# Altium project Vertap.PrjPcb
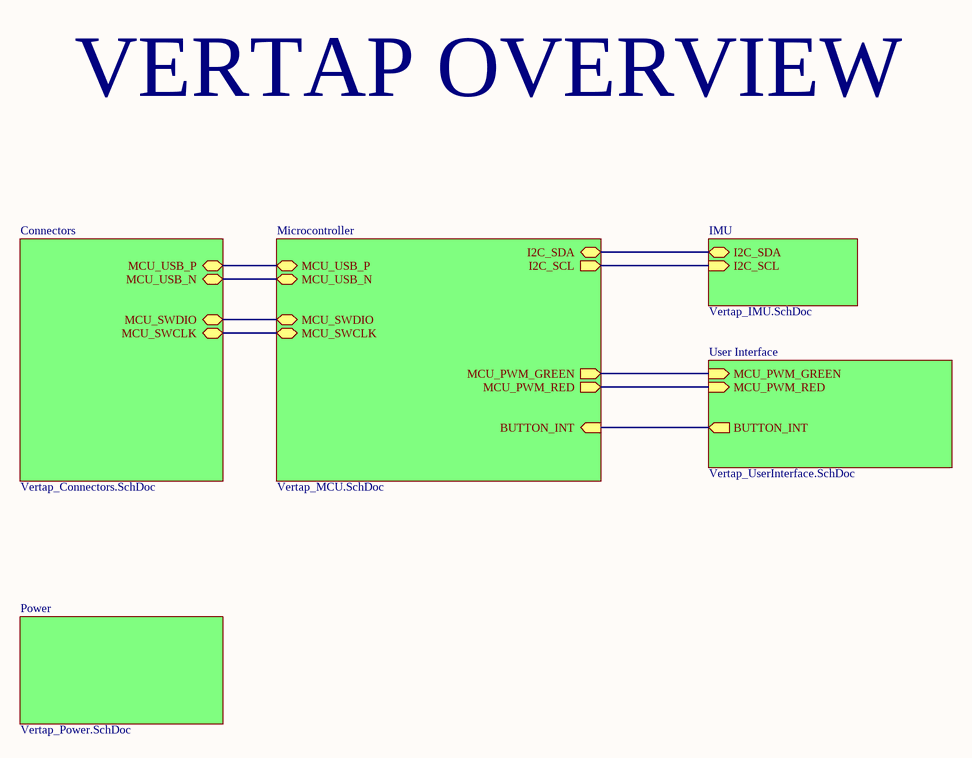
[diagram p0: Vertap_Overview.SchDoc]
6 sheets, 38 parts. Net scope: hierarchical (ports join the sheet entries above them; power ports are global).
Board file: Vertap_PCB.PcbDoc
Sheets:
  Vertap_Overview.SchDoc
    Power = Vertap_Power.SchDoc
    IMU = Vertap_IMU.SchDoc
    Microcontroller = Vertap_MCU.SchDoc
    User Interface = Vertap_UserInterface.SchDoc
    Connectors = Vertap_Connectors.SchDoc

## Sheet Vertap_Overview.SchDoc: Overview
size A4; Author: Taim Al-Dabbagh; DrawnBy: Taim Al-Dabbagh; Revision: v1; SheetNumber: 1; SheetTotal: 6

### Sub-sheets
Connectors = Vertap_Connectors.SchDoc: MCU_SWCLK (bidir), MCU_SWDIO (bidir), MCU_USB_N (bidir), MCU_USB_P (bidir)
IMU = Vertap_IMU.SchDoc: I2C_SDA (bidir), I2C_SCL (in)
Microcontroller = Vertap_MCU.SchDoc: I2C_SDA (bidir), I2C_SCL (out), MCU_SWCLK (bidir), MCU_SWDIO (bidir), MCU_USB_N (bidir), MCU_USB_P (bidir), BUTTON_INT (in), MCU_PWM_GREEN (out), MCU_PWM_RED (out)
Power = Vertap_Power.SchDoc: no entries
User Interface = Vertap_UserInterface.SchDoc: BUTTON_INT (out), MCU_PWM_GREEN (in), MCU_PWM_RED (in)

### Nets
BUTTON_INT: sheet Microcontroller/BUTTON_INT, sheet User Interface/BUTTON_INT
I2C_SCL: sheet IMU/I2C_SCL, sheet Microcontroller/I2C_SCL
I2C_SDA: sheet IMU/I2C_SDA, sheet Microcontroller/I2C_SDA
MCU_PWM_GREEN: sheet Microcontroller/MCU_PWM_GREEN, sheet User Interface/MCU_PWM_GREEN
MCU_PWM_RED: sheet Microcontroller/MCU_PWM_RED, sheet User Interface/MCU_PWM_RED
MCU_SWCLK: sheet Microcontroller/MCU_SWCLK, sheet Connectors/MCU_SWCLK
MCU_SWDIO: sheet Microcontroller/MCU_SWDIO, sheet Connectors/MCU_SWDIO
MCU_USB_N: sheet Microcontroller/MCU_USB_N, sheet Connectors/MCU_USB_N
MCU_USB_P: sheet Microcontroller/MCU_USB_P, sheet Connectors/MCU_USB_P

### Notes on the sheet
- VERTAP OVERVIEW

## Sheet Vertap_Power.SchDoc: Power
size A4; Author: Taim Al-Dabbagh; DrawnBy: Taim Al-Dabbagh; Revision: v1; SheetNumber: 2; SheetTotal: 6
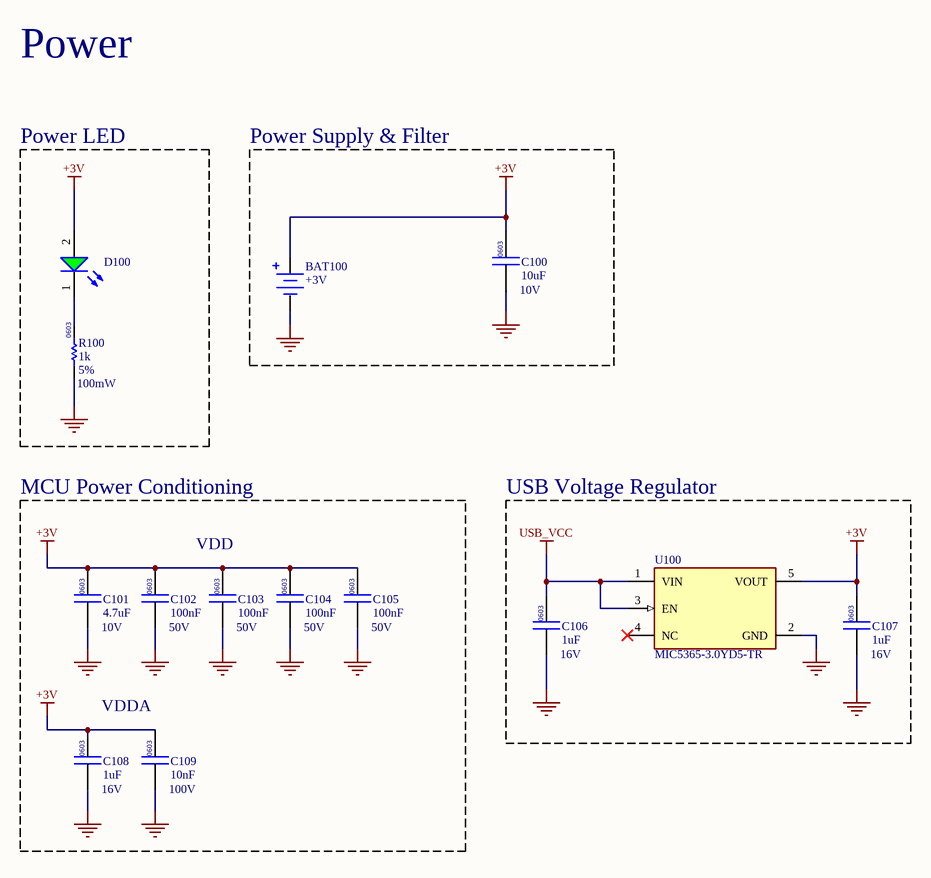
[diagram p1: Vertap_Power.SchDoc]

### Parts
BAT100  +3V  [BH-67D-5]
C100  10uF  [CAP_0603_MURATA]
C101  4.7uF  [CAP_0603_MURATA]
C102  100nF  [CAP_0603_MURATA]
C103  100nF  [CAP_0603_MURATA]
C104  100nF  [CAP_0603_MURATA]
C105  100nF  [CAP_0603_MURATA]
C106  1uF  [CAP_0603_MURATA]
C107  1uF  [CAP_0603_MURATA]
C108  1uF  [CAP_0603_MURATA]
C109  10nF  [CAP_0603_MURATA]
D100  150060VS75000  [WL-SMCW_0603_150060xx75000]  (value not drawn)
R100  1k  [RESC1608X55X25LL10T15]
U100  MIC5365-3.0YD5-TR  [FP-TSOT-5LD-PL-1-MFG]

### Blocks framed on the sheet
Power LED: D100 R100
Power Supply & Filter: BAT100 C100
MCU Power Conditioning: C101-C105 C108 C109
USB Voltage Regulator: C106 C107 U100

### Nets
+3V: BAT100.2(+) C100.1 C101.1 C102.1 C103.1 C104.1 C105.1 C107.1 C108.2 C109.1 D100.2(A) U100.5(VOUT)
GND: BAT100.1(-) C100.2 C101.2 C102.2 C103.2 C104.2 C105.2 C106.2 C107.2 C108.1 C109.2 R100.1 U100.2(GND)
USB_VCC: C106.1 U100.1(VIN) U100.3(EN)
NetD100_1: D100.1(K) R100.2

Not connected (* = marked no-connect by the designer): U100 4(NC)*

### Notes on the sheet
- Power
- (near C100) 0603
- (near C100) 10V
- (near R100) 0603
- (near R100) 100mW
- (near R100) 5%
- (near C101) 0603
- (near C102) 0603
- VDD
- (near C103) 0603
- (near C104) 0603
- (near C105) 0603
- (near C101) 10V
- (near C102) 50V
- (near C103) 50V
- (near C104) 50V
- (near C105) 50V
- (near C106) 0603
- (near C106) 16V
- (near C107) 0603
- (near C107) 16V
- VDDA
- (near C108) 0603
- (near C108) 16V
- (near C109) 0603
- (near C109) 100V

### Library data of the parts
BAT100 = BH-67D-5: BATT RETAINER COIN 20MM 1CEL SMD; Supplier 1: Digi-Key; Supplier Part Number 1: 2057-BH-67D-5-ND
C100 = CAP_10uF_0603: CAP CER 10UF 10V X7R 0603; Supplier 1: Arrow Electronics; Supplier Part Number 1: GRM188Z71A106KA73D
C101 = CAP_4.7uF_0603: CAP CER 4.7UF 10V X7R 0603; Supplier 1: Digi-Key
C102-C105 = CAP_0.1uF_0603: CAP CER 0.1UF 50V X7R 0603; Supplier 1: Mouser; Supplier Part Number 1: 81-GCM188R71H104JA7D
C106-C108 = CAP_1uF_0603: CAP CER 1UF 16V X7R 0603; Supplier 1: Arrow Electronics
  C106 C107: Supplier Part Number 1: GCM188R71C105KA64J
C109 = CAP_10nF_0603: CAP CER 10000PF 100V X7R 0603; Supplier 1: Arrow Electronics; Supplier Part Number 1: GCM188R72A103KA37J
D100 = CMP-1426-00006-6: NexarPartId: 29717778; Reverse Voltage: 5V; Forward Voltage: 2V; Viewing Angle: 140°; Luminous Intensity: 40mcd; Test Current: 20mA; Max Junction Temperature (Tj): 95°C; Wavelength: 570nm; Forward Current: 100mA; Color: Green; Lens Style: Clear, Rectangular; Power Dissipation: 72mW; Peak Wavelength: 572nm; Packaging: Tape and Reel; REACH SVHC: Unknown; Width: 800µm; Max Operating Temperature: 85°C; Number of Pins: 2; RoHS: Compliant; Dominant Wavelength: 570nm; Min Operating Temperature: -40°C; Case Code (Imperial): 0603; Height: 700µm; Length: 1.6mm; Case Code (Metric): 1608; Case/Package: 0603; Max Reverse Voltage (DC): 5V; Mount: Surface Mount
R100 = CMP-2000-04305-1: Manufacturer: Yageo; Part Number: RC0603JR-101KL
U100 = CMP-00252-66803206-1: MIC5365-3.0YD5-TR LDO Regulator Pos 3V 0.15A 5-Pin TSOT-23 T/R; Min Supply Voltage: 2.5V; Max Supply Voltage: 5.5V; Dropout Voltage: 155mV; Min Current Limit: 200mA; Max Junction Temperature (Tj): 125°C; Output Current: 150mA; Number of Outputs: 1; Accuracy: 2%; Mount: Surface Mount; NexarPartId: 66803206; Lifecycle Status: Production; Min Operating Temperature: -40°C; Height: 1mm; RoHS: Compliant; Max Operating Temperature: 125°C; Number of Regulators: 1; Case/Package: SOT-23-5; Output Voltage: 3V

## Sheet Vertap_IMU.SchDoc: IMU
size A4; Author: Taim Al-Dabbagh; DrawnBy: Taim Al-Dabbagh; Revision: v1; SheetNumber: 3; SheetTotal: 6
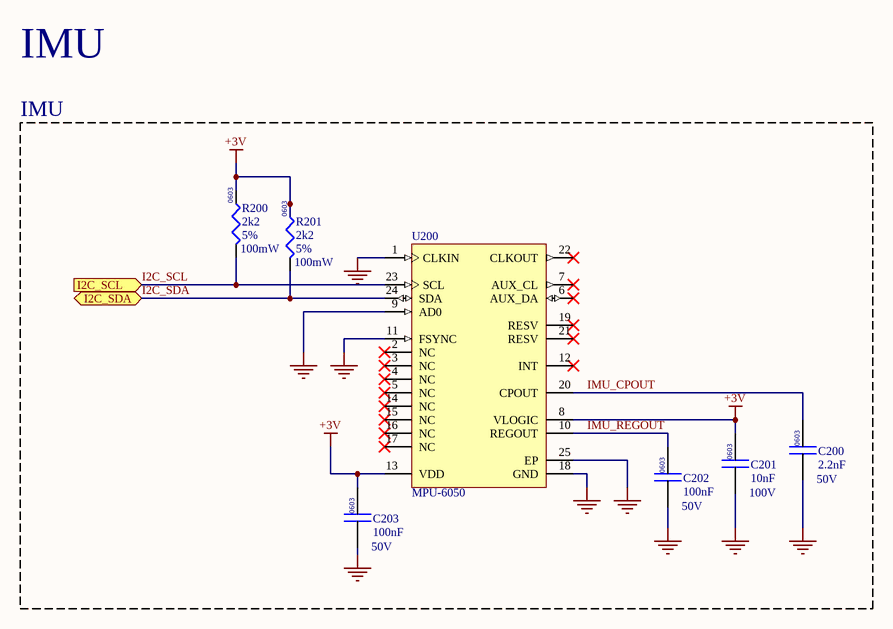
[diagram p2: Vertap_IMU.SchDoc]

### Parts
C200  2.2nF  [CAP_0603_MURATA]
C201  10nF  [CAP_0603_MURATA]
C202  100nF  [CAP_0603_MURATA]
C203  100nF  [CAP_0603_MURATA]
R200  2k2  [RES_0603_YAGEO]
R201  2k2  [RES_0603_YAGEO]
U200  MPU-6050  [IS-QFN-24_V]

### Ports
I2C_SCL (in), I2C_SDA (bidir)

### Nets
+3V: C201.1 C203.1 R200.1 R201.1 U200.8(VLOGIC) U200.13(VDD)
GND: C200.2 C201.2 C202.2 C203.2 U200.1(CLKIN) U200.9(AD0) U200.11(FSYNC) U200.18(GND) U200.25(EP)
I2C_SCL: R200.2 U200.23(SCL) ; port I2C_SCL
I2C_SDA: R201.2 U200.24(SDA) ; port I2C_SDA
IMU_CPOUT: C200.1 U200.20(CPOUT)
IMU_REGOUT: C202.1 U200.10(REGOUT)

Not connected (* = marked no-connect by the designer): U200 2(NC)* 3(NC)* 4(NC)* 5(NC)* 6(AUX_DA)* 7(AUX_CL)* 12(INT)* 14(NC)* 15(NC)* 16(NC)* 17(NC)* 19(RESV)* 21(RESV)* 22(CLKOUT)*

### Notes on the sheet
- IMU
- (near R200) 0603
- (near R200) 5%
- (near R201) 0603
- (near R200) 100mW
- (near R201) 100mW
- (near R201) 5%
- (near C200) 0603
- (near C203) 0603
- (near C202) 0603
- (near C202) 50V
- (near C201) 0603
- (near C201) 100V
- (near C200) 50V
- (near C203) 50V

### Library data of the parts
C200 = CAP_2.2nF_0603: 2200 pF ±20% 50V Ceramic Capacitor X7R 0603 (1608 Metric); Supplier 1: Mouser; Supplier Part Number 1: 81-GCD188R71H222MA1D
C201 = CAP_10nF_0603: CAP CER 10000PF 100V X7R 0603; Supplier 1: Arrow Electronics; Supplier Part Number 1: GCM188R72A103KA37J
C202 C203 = CAP_0.1uF_0603: CAP CER 0.1UF 50V X7R 0603; Supplier 1: Mouser; Supplier Part Number 1: 81-GCM188R71H104JA7D
R200 R201 = RES_0603_2.2K: RES 2.2K OHM 5% 1/10W 0603; Manufacturer: YAGEO; Manufacturer Part Number: RC0603JR-072K2L; Supplier 1: Future Electronics; Supplier Part Number 1: 9707183
U200 = CMP-010-00024-1: Analog Circuit, 1 Func, CMOS; Nominal Supply Voltage: 2.5V; Max Supply Voltage: 3.46V; Min Supply Voltage: 2.375V; RoHS Compliant: Yes; Max Operating Temperature: 85°C; Min Operating Temperature: -40°C; Pins: 24; Case/Package: HVQCCN

## Sheet Vertap_MCU.SchDoc: MCU
size 381 x 241 mm; Author: Taim Al-Dabbagh; DrawnBy: Taim Al-Dabbagh; Revision: v1; SheetNumber: 4; SheetTotal: 6
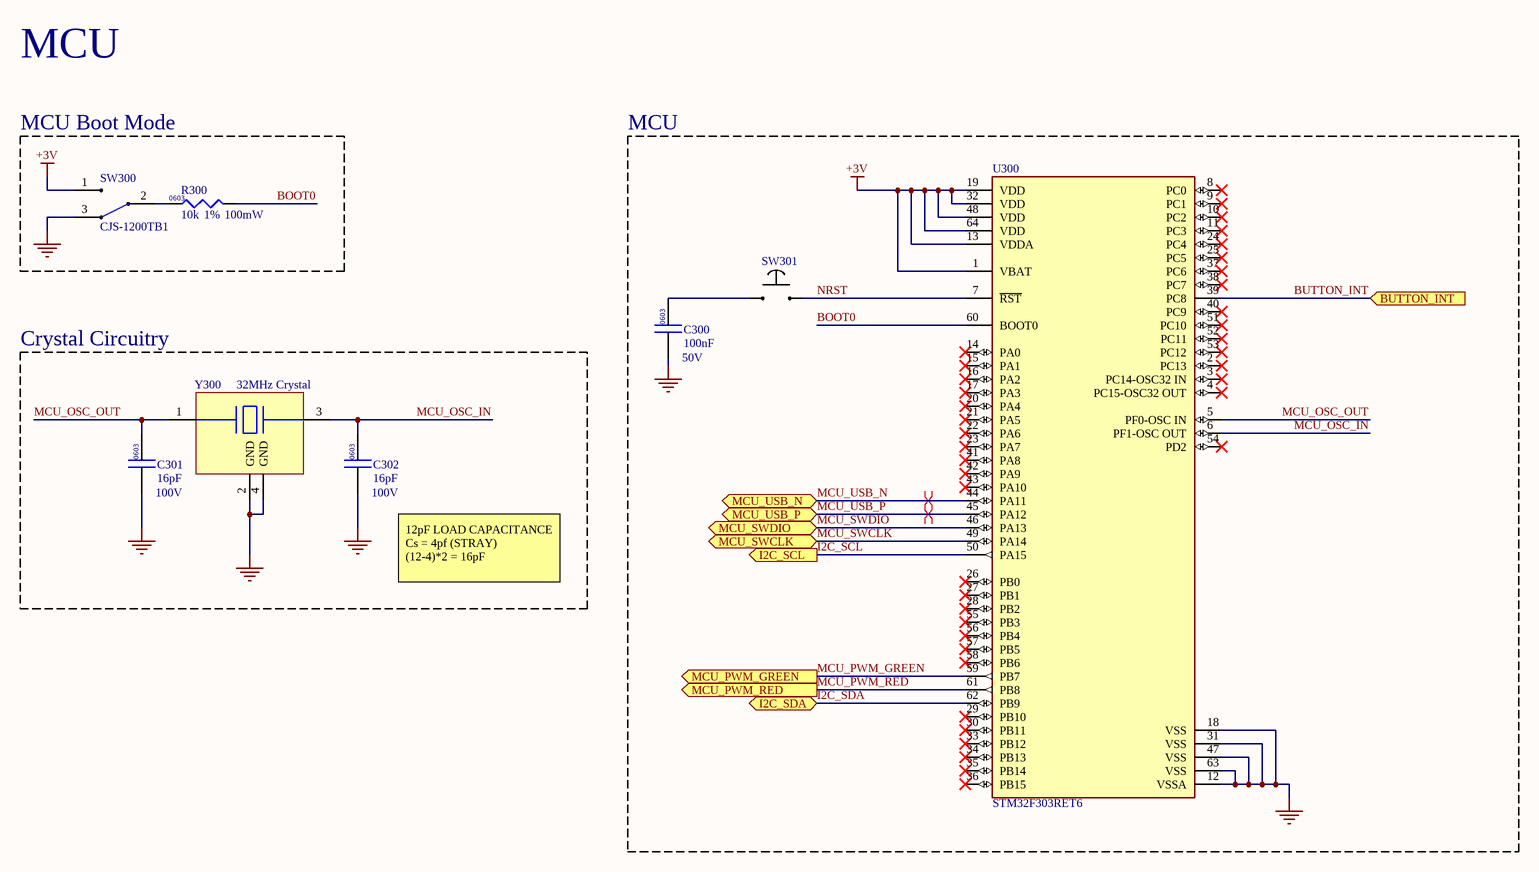
[diagram p3: Vertap_MCU.SchDoc]

### Parts
C300  100nF  [CAP_0603_MURATA]
C301  16pF  [CAP_0603_MURATA]
C302  16pF  [CAP_0603_MURATA]
R300  10k  [RES_0603_YAGEO]
SW300  CJS-1200TB1  [CJS-1200TB1]
SW301  LS38G2F-T  [LS38G2F-T]  (value not drawn)
U300  STM32F303RET6  [FP-LQFP64-5W-MFG]
Y300  32MHz Crystal  [CX2016SA32000H0FLJG1]

### Blocks framed on the sheet
MCU Boot Mode: R300 SW300
MCU: C300 SW301 U300
Crystal Circuitry: C301 C302 Y300

### Ports
BUTTON_INT (in), I2C_SCL (out), I2C_SDA (bidir), MCU_PWM_GREEN (out), MCU_PWM_RED (out), MCU_SWCLK (bidir), MCU_SWDIO (bidir), MCU_USB_N (bidir), MCU_USB_P (bidir)

### Nets
+3V: SW300.1 U300.1(VBAT) U300.13(VDDA) U300.19(VDD) U300.32(VDD) U300.48(VDD) U300.64(VDD)
GND: C300.2 C301.2 C302.2 SW300.3 U300.12(VSSA) U300.18(VSS) U300.31(VSS) U300.47(VSS) U300.63(VSS) Y300.2(GND) Y300.4(GND)
BOOT0: R300.2 U300.60(BOOT0)
BUTTON_INT: U300.39(PC8) ; port BUTTON_INT
I2C_SCL: U300.50(PA15) ; port I2C_SCL
I2C_SDA: U300.62(PB9) ; port I2C_SDA
MCU_OSC_IN: C302.1 U300.6(PF1-OSC_OUT) Y300.3(OUT)
MCU_OSC_OUT: C301.1 U300.5(PF0-OSC_IN) Y300.1(IN)
MCU_PWM_GREEN: U300.59(PB7) ; port MCU_PWM_GREEN
MCU_PWM_RED: U300.61(PB8) ; port MCU_PWM_RED
MCU_SWCLK: U300.49(PA14) ; port MCU_SWCLK
MCU_SWDIO: U300.46(PA13) ; port MCU_SWDIO
MCU_USB_N: U300.44(PA11) ; port MCU_USB_N
MCU_USB_P: U300.45(PA12) ; port MCU_USB_P
NRST: SW301.2 U300.7(~{RST})
NetC300_1: C300.1 SW301.1
NetR300_1: R300.1 SW300.2

Not connected (* = marked no-connect by the designer): U300 2(PC13)* 3(PC14-OSC32_IN)* 4(PC15-OSC32_OUT)* 8(PC0)* 9(PC1)* 10(PC2)* 11(PC3)* 14(PA0)* 15(PA1)* 16(PA2)* 17(PA3)* 20(PA4)* 21(PA5)* 22(PA6)* 23(PA7)* 24(PC4)* 25(PC5)* 26(PB0)* 27(PB1)* 28(PB2)* 29(PB10)* 30(PB11)* 33(PB12)* 34(PB13)* 35(PB14)* 36(PB15)* 37(PC6)* 38(PC7)* 40(PC9)* 41(PA8)* 42(PA9)* 43(PA10)* 51(PC10)* 52(PC11)* 53(PC12)* 54(PD2)* 55(PB3)* 56(PB4)* 57(PB5)* 58(PB6)*

### Layout directives
differential pair; differential pair class USB: MCU_USB_N, MCU_USB_P

### Notes on the sheet
- MCU
- (near R300) 0603
- (near R300) 1%
- (near R300) 100mW
- (near C300) 0603
- (near C300) 50V
- (near C301) 0603
- 100V
- (near C302) 0603
- (near C302) 100V
- 12pF LOAD CAPACITANCE
  Cs = 4pf (STRAY)
  (12-4)*2 = 16pF

### Library data of the parts
C300 = CAP_0.1uF_0603: CAP CER 0.1UF 50V X7R 0603; Supplier 1: Mouser; Supplier Part Number 1: 81-GCM188R71H104JA7D
C301 C302 = CAP_16pF_0603: CAP CER 16PF 100V C0G/NP0 0603; Supplier 1: Arrow Electronics
R300 = RES_0603_10K: RES 10K OHM 1% 1/10W 0603; Manufacturer: YAGEO; Manufacturer Part Number: AC0603FR-1310KL; Supplier 1: Arrow Electronics
SW300 = CJS-1200TB1: SWITCH SLIDE SPDT 100MA 6V; Supplier 1: Avnet; Supplier Part Number 1: CJS-1200TB1
SW301 = LS38G2F-T: TOP-PRESS TACTILE SWITCH; Supplier 1: Digi-Key; Supplier Part Number 1: 1642-LS38G2F-TCT-ND
U300 = CMP-0537-00048-2: IC MCU 32BIT 512KB FLASH 64LQFP; Manufacturer: STMicroelectronics; Data Bus Width: 32bits; Standoff Height: 0.05mm; Number Of Pwm Channels: 31; Number Of Timers/Counters: 6; Min Supply Voltage: 2V; Number Of Spi Channels: 4; Core Architecture: ARM Cortex-M4; Number Of I2C Channels: 3; Number Of Usb Channels: 1; Max Supply Voltage: 3.6V; Interface: I2C,SPI,UART,USART,CAN,USB,LIN,IrDA,I2S; Frequency: 72MHz; Max Junction Temp: +105°C; Number Of Uart Channels: 2; Number Of I/Os: 26; Memory Size: 512KBytes; Number Of Adc Channels: 22; Ram Size: 80KBytes; Nominal Supply Current: 4.27-66.4mA; ComponentLink2URL: https://www.st.com/resource/en/datasheet/stm32f303re.pdf; Automotive: No; Mouser Description: MCU 32-Bit STM32 ARM Cortex M4 RISC 512KB Flash 2.5V/3.3V 64-Pin LQFP Tray; Memory Type: FLASH; Temperature: -40°C to +105°C; Temperature Range Low: -40°C; Manufacturer Part Number: STM32F303RET6; Number Of A/D Converters: 4; Ambient Temperature Range High: +85°C; RoHS: TRUE; Category: IC; Ambient Temperature Range Low: -40°C; Number Of Cores: 1; Octopart: https://octopart.com/stm32f303ret6-stmicroelectronics-53115257; Height: 1.6mm; Device Class L2: Embedded Processors and Controllers; Device Class L3: Microcontrollers; Temperature Range High: +105°C; ComponentLink2Description: Datasheet; Lead Free: Yes; Digikey Description: IC MCU 32BIT 512KB FLASH 64LQFP; Package: LQFP64-5W; Device Class L1: Integrated Circuits (ICs)
Y300 = CX2016SA32000H0FLJG1: 32 MHz ±10ppm Crystal 12pF 60 Ohms 4-SMD, No Lead; Supplier 1: Digi-Key; Supplier Part Number 1: 478-CX2016SA32000H0FLJG1CT-ND

## Sheet Vertap_UserInterface.SchDoc: UserInterface
size A4; Author: Taim Al-Dabbagh; DrawnBy: Taim Al-Dabbagh; Revision: v1; SheetNumber: 6; SheetTotal: 6
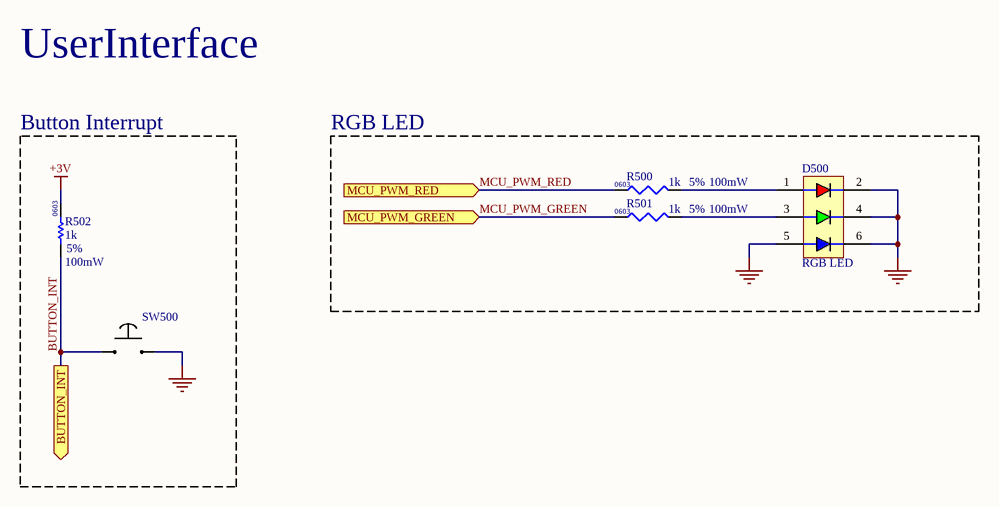
[diagram p4: Vertap_UserInterface.SchDoc]

### Parts
D500  RGB LED  [ASMB-TTF0-0A20B]
R500  1k  [RES_0603_YAGEO]
R501  1k  [RES_0603_YAGEO]
R502  1k  [RESC1608X55X25LL10T15]
SW500  LS38G2F-T  [LS38G2F-T]  (value not drawn)

### Blocks framed on the sheet
Button Interrupt: R502 SW500
RGB LED: D500 R500 R501

### Ports
BUTTON_INT (out), MCU_PWM_GREEN (in), MCU_PWM_RED (in)

### Nets
+3V: R502.2
GND: D500.2(RED-) D500.4(GREEN-) D500.5(BLUE+) D500.6(BLUE-) SW500.2
BUTTON_INT: R502.1 SW500.1 ; port BUTTON_INT
MCU_PWM_GREEN: R501.1 ; port MCU_PWM_GREEN
MCU_PWM_RED: R500.1 ; port MCU_PWM_RED
NetD500_1: D500.1(RED+) R500.2
NetD500_3: D500.3(GREEN+) R501.2

### Notes on the sheet
- UserInterface
- (near R502) 0603
- (near R500) 0603
- (near R501) 0603
- 5%
- 100mW
- (near R502) 100mW
- (near R502) 5%

### Library data of the parts
D500 = ASMB-TTF0-0A20B: Red, Green, Blue (RGB) 621nm Red, 522nm Green, 468nm Blue LED Indication - Discrete 2.1V Red, 2.9V Green, 2.9V Blue 4-SMD, J-Lead; Supplier 1: Newark; Supplier Part Number 1: 57AC0504
R500 R501 = RES_0603_1K: RES 1K OHM 5% 1/10W 0603; Manufacturer: YAGEO; Manufacturer Part Number: RC0603JR-101KL; Supplier 1: Arrow Electronics; Supplier Part Number 1: RC0603JR-101KL
R502 = CMP-2000-04305-1: as R100 on sheet Vertap_Power
SW500 = LS38G2F-T: TOP-PRESS TACTILE SWITCH; Supplier 1: Digi-Key; Supplier Part Number 1: 1642-LS38G2F-TCT-ND

## Sheet Vertap_Connectors.SchDoc: Connectors
size A4; Author: Taim Al-Dabbagh; DrawnBy: Taim Al-Dabbagh; Revision: v1; SheetNumber: 5; SheetTotal: 6
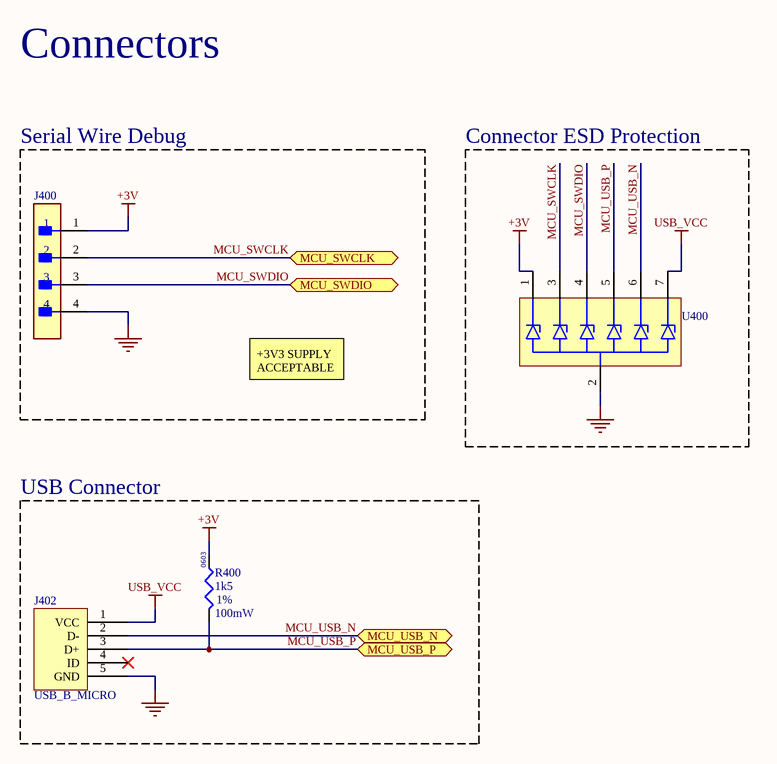
[diagram p5: Vertap_Connectors.SchDoc]

### Parts
J400  GEC04SBSN-M89  [FP-GEC04SBSN-M89-MFG]  (value not drawn)
J402  USB_B_MICRO  [MUSB-B5-S-RA-SMT-PP-T/R]
R400  1k5  [RES_0603_YAGEO]
U400  PUSB3FR6Z  [PUSB3FR6Z]  (value not drawn)

### Blocks framed on the sheet
Serial Wire Debug: J400
Connector ESD Protection: U400
USB Connector: J402 R400

### Ports
MCU_SWCLK (bidir), MCU_SWDIO (bidir), MCU_USB_N (bidir), MCU_USB_P (bidir)

### Nets
+3V: J400.1 R400.1 U400.1
GND: J400.4 J402.5(GND) U400.2(GND)
USB_VCC: J402.1(VCC) U400.7
MCU_SWCLK: J400.2 U400.3 ; port MCU_SWCLK
MCU_SWDIO: J400.3 U400.4 ; port MCU_SWDIO
MCU_USB_N: J402.2(D-) U400.6 ; port MCU_USB_N
MCU_USB_P: J402.3(D+) R400.2 U400.5 ; port MCU_USB_P

Not connected (* = marked no-connect by the designer): J402 4(ID)*

### Notes on the sheet
- Connectors
- +3V3 SUPPLY ACCEPTABLE
- (near R400) 0603
- (near R400) 100mW
- (near R400) 1%

### Library data of the parts
J400 = CMP-25680-000072-1: CONN HEADER SMD R/A 4POS 2.54MM; Number of Contacts: 4; Pitch: 0.1inch; Gender: Male; Connector Type: Male Pin; Termination: Solder; Flammability Rating: UL94 V-0; Insulation Material: Nylon; Lead Free: Lead Free; Contact Mating Length: 0.23inch; Housing Material: Plastic; Contact Plating: Tin; Package Quantity: 1; Contact Finish - Mating: TIN; Series: -; Length: 10.2mm; Insulation Color: Black; Number of Positions: 4; Min Operating Temperature: -65°C; Height: 3.56mm; Housing Color: Black; Width: 2.54mm; Max Operating Temperature: 150°C; Mount: Surface Mount; RoHS Compliant: Yes; Contact Type: Male Pin; Contact Material: Bronze; Packaging: Bulk; Number of Rows: 1; Contact Shape: Square; Color: Black; Fastening Type: Pull
J402 = MUSB-B5-S-RA-SMT-PP-T/R: MINI USB, TYPE B, RIGHT ANGLE, S; Supplier 1: Arrow Electronics; Supplier Part Number 1: MUSB-B5-S-RA-SMT-PP-T/R
R400 = RES_0603_1.5K: RES 1.5K OHM 1% 1/10W 0603; Manufacturer: YAGEO; Manufacturer Part Number: RC0603FR-131K5L; Supplier 1: Future Electronics; Supplier Part Number 1: 7064402
U400 = PUSB3FR6Z: TVS DIODE 3.3VWM 3VC 7XSON; Supplier 1: Arrow Electronics; Supplier Part Number 1: PUSB3FR6Z

## Nets that join several sheets
+3V: Vertap_Power (12 pins), Vertap_IMU (6 pins), Vertap_MCU (7 pins), Vertap_UserInterface (R502.2), Vertap_Connectors (J400.1 R400.1 U400.1)
GND: Vertap_Power (13 pins), Vertap_IMU (9 pins), Vertap_MCU (11 pins), Vertap_UserInterface (5 pins), Vertap_Connectors (J400.4 J402.5 U400.2)
USB_VCC: Vertap_Power (C106.1 U100.1 U100.3), Vertap_Connectors (J402.1 U400.7)
BUTTON_INT: Vertap_MCU (U300.39), Vertap_UserInterface (R502.1 SW500.1)
I2C_SCL: Vertap_IMU (R200.2 U200.23), Vertap_MCU (U300.50)
I2C_SDA: Vertap_IMU (R201.2 U200.24), Vertap_MCU (U300.62)
MCU_PWM_GREEN: Vertap_MCU (U300.59), Vertap_UserInterface (R501.1)
MCU_PWM_RED: Vertap_MCU (U300.61), Vertap_UserInterface (R500.1)
MCU_SWCLK: Vertap_MCU (U300.49), Vertap_Connectors (J400.2 U400.3)
MCU_SWDIO: Vertap_MCU (U300.46), Vertap_Connectors (J400.3 U400.4)
MCU_USB_N: Vertap_MCU (U300.44), Vertap_Connectors (J402.2 U400.6)
MCU_USB_P: Vertap_MCU (U300.45), Vertap_Connectors (J402.3 R400.2 U400.5)